# EAGLE design LAUNCHXL-F28069_B_1400922 (EAGLE 8.3.1)

## Sheet 1 of 4
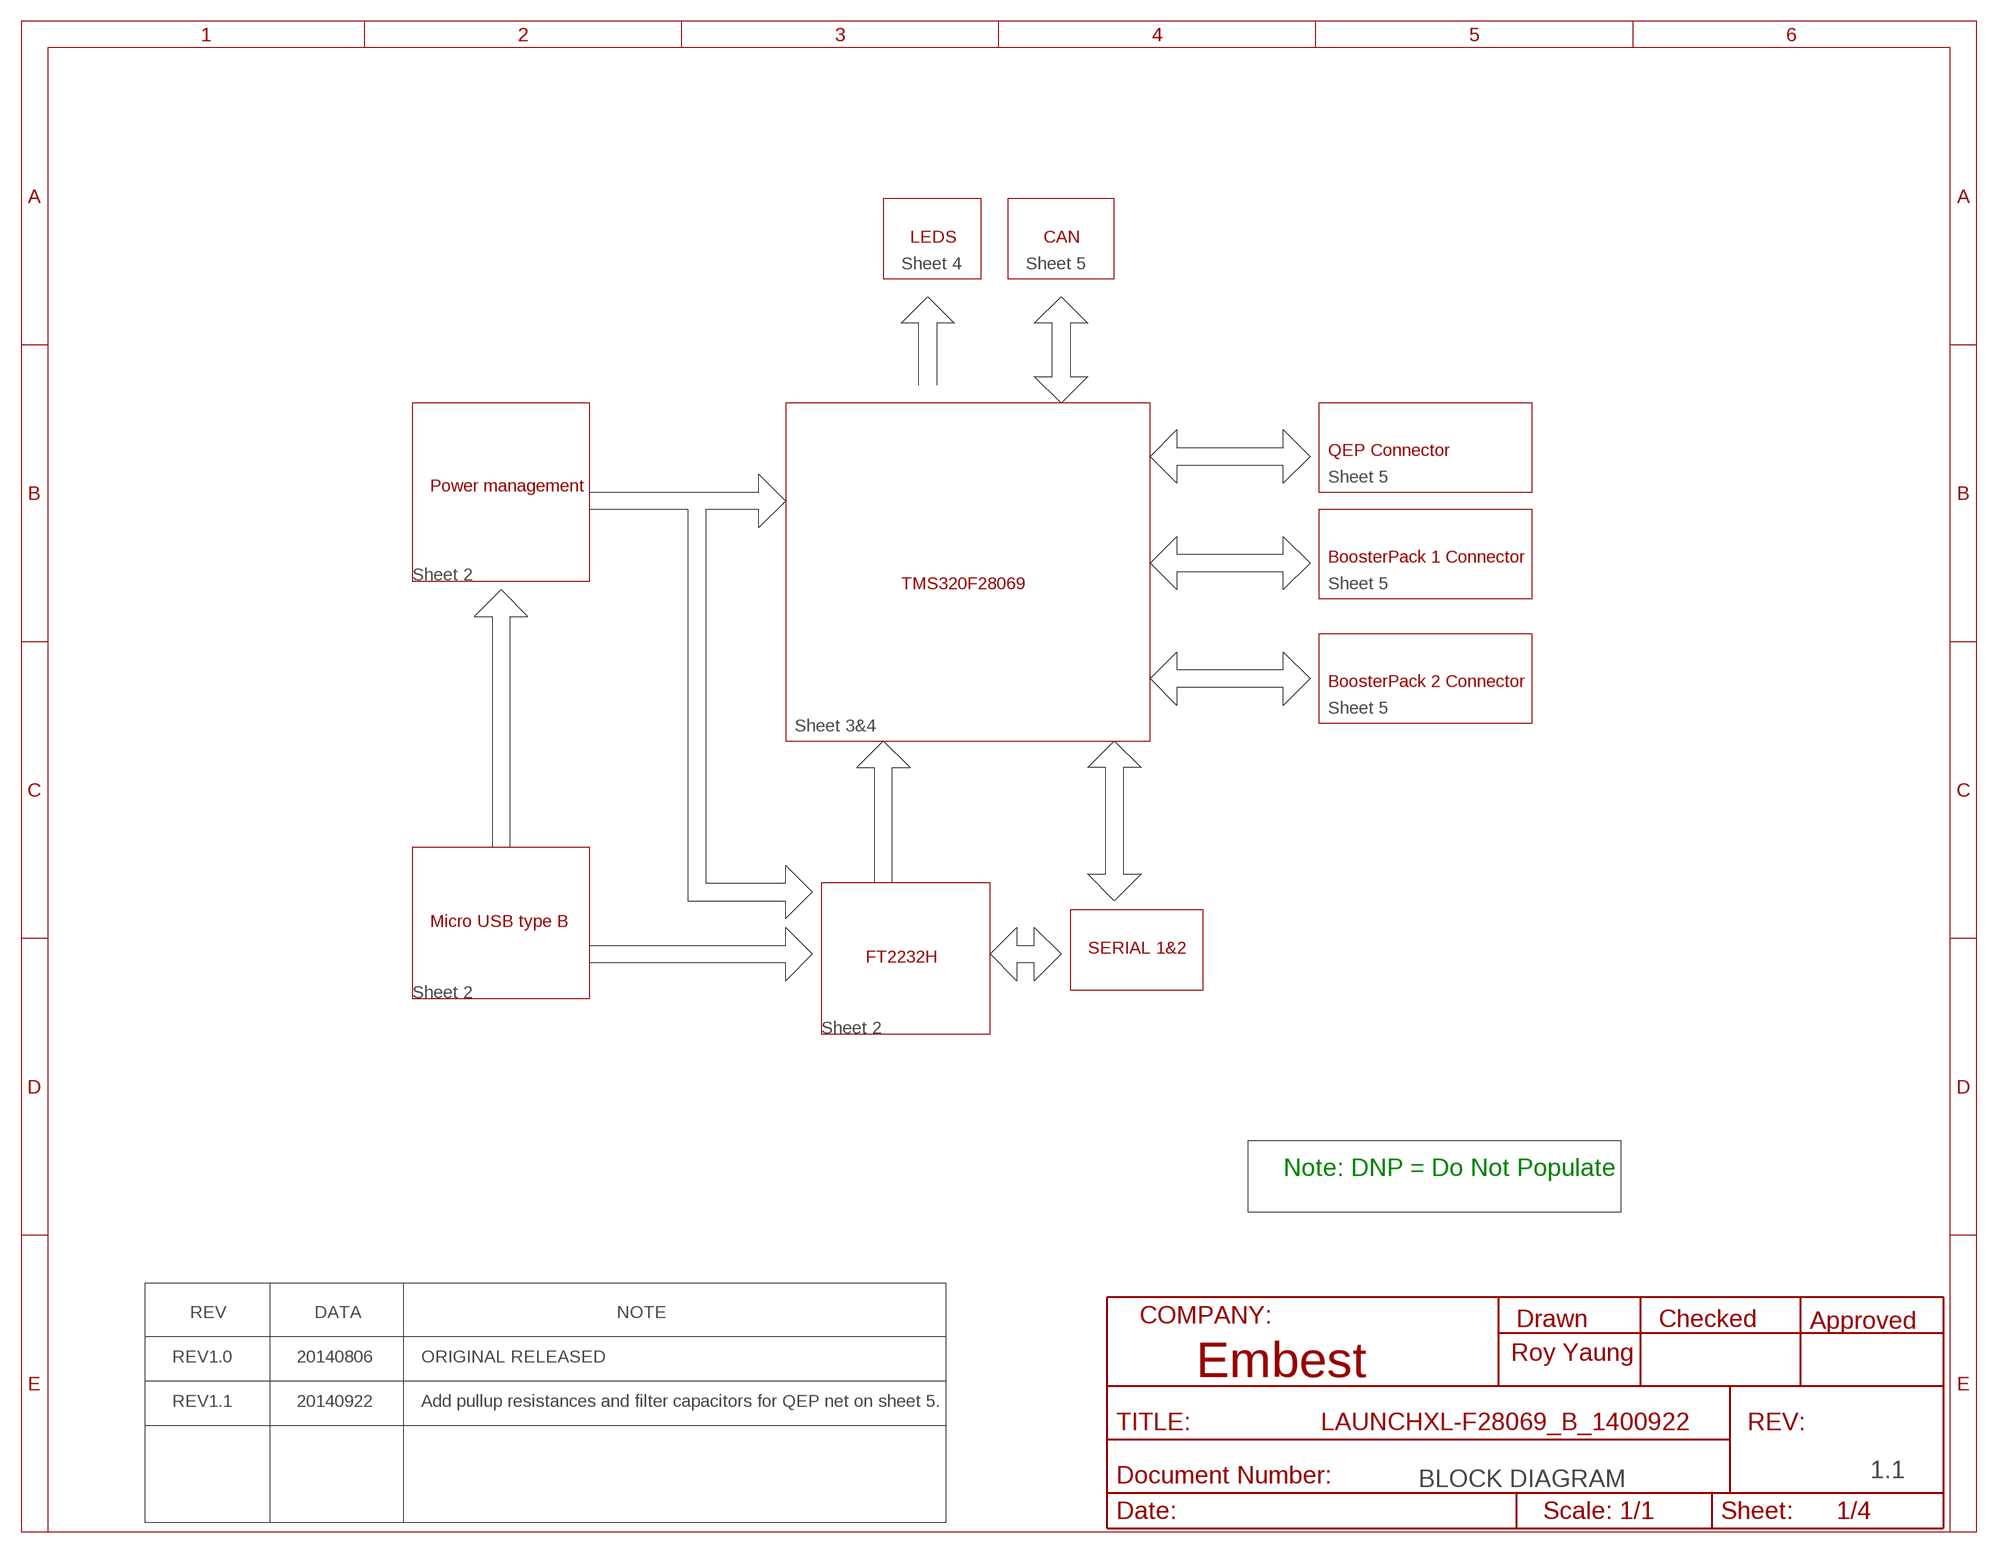
[diagram p0: schematic, sheet 1]

### Notes on the sheet
- LEDS | CAN
- Sheet 4 | Sheet 5
- QEP Connector
- Sheet 5
- Power management
- BoosterPack 1 Connector
- Sheet 2
- TMS320F28069 | Sheet 5
- BoosterPack 2 Connector
- Sheet 5
- Sheet 3&4
- Micro USB type B
- SERIAL 1&2
- FT2232H
- Sheet 2
- Sheet 2
- Note: DNP = Do Not Populate
- REV | DATA | NOTE
- REV1.0 | 20140806 | ORIGINAL RELEASED | Roy Yaung
- REV1.1 | 20140922 | Add pullup resistances and filter capacitors for QEP net on sheet 5.
- 1.1
- BLOCK DIAGRAM

## Sheet 2 of 4
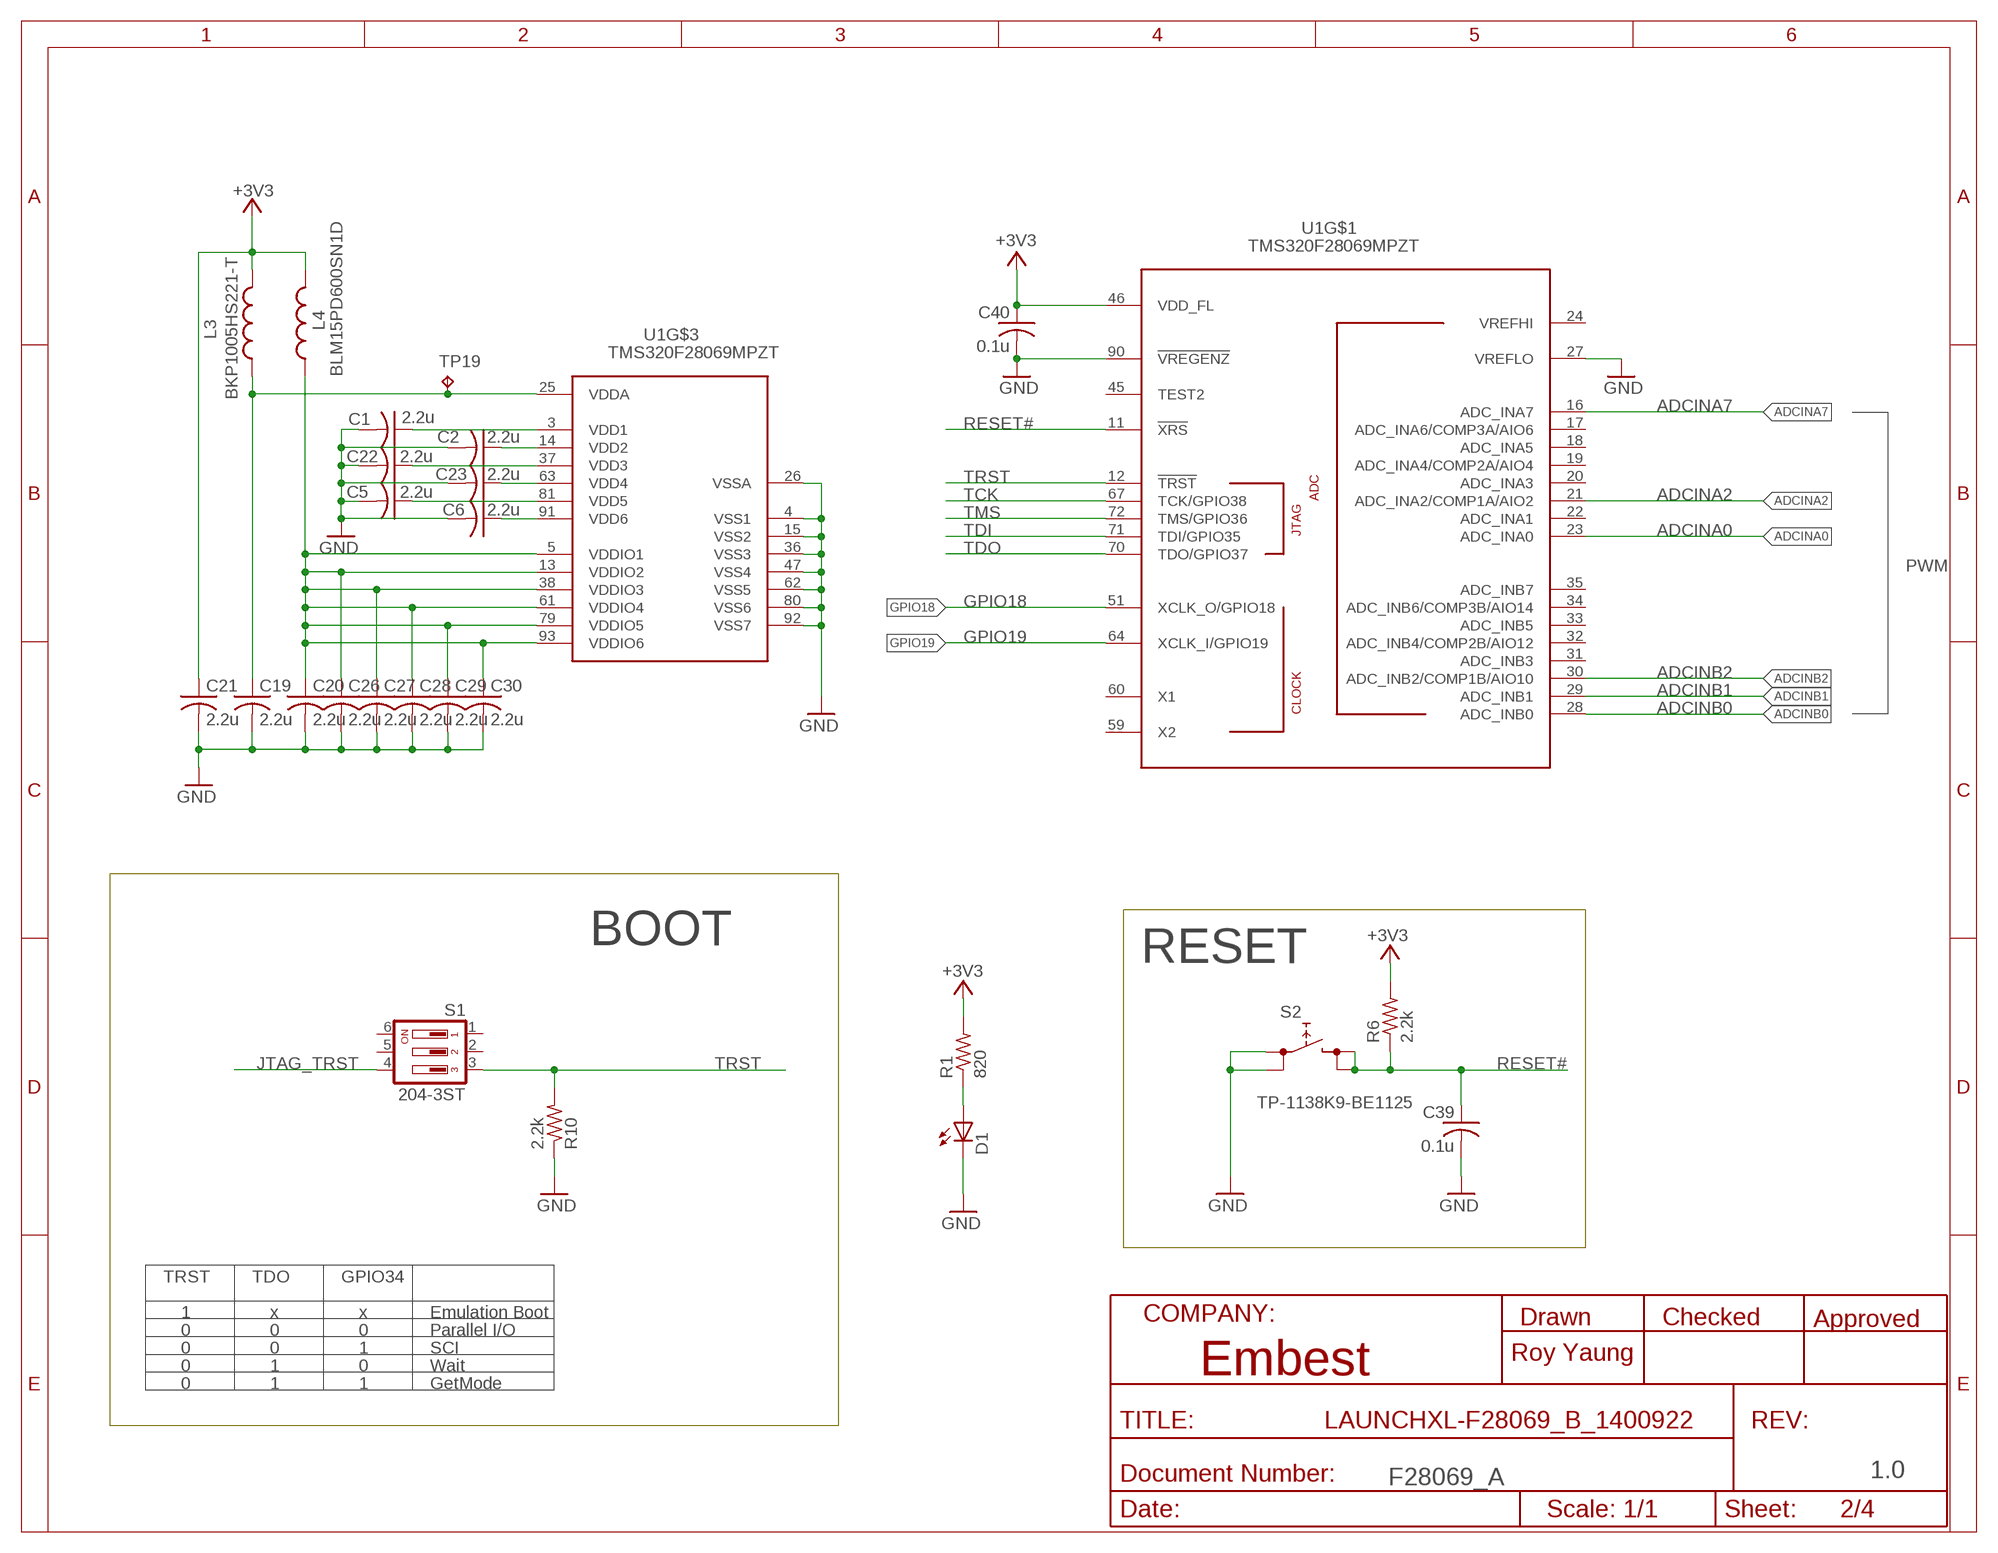
[diagram p1: schematic, sheet 2]

### Parts
C1  2.2u  C-USC0402  [C0402]
C2  2.2u  C-USC0402  [C0402]
C5  2.2u  C-USC0402  [C0402]
C6  2.2u  C-USC0402  [C0402]
C19  2.2u  C-USC0402  [C0402]
C20  2.2u  C-USC0402  [C0402]
C21  2.2u  C-USC0402  [C0402]
C22  2.2u  C-USC0402  [C0402]
C23  2.2u  C-USC0402  [C0402]
C26  2.2u  C-USC0402  [C0402]
C27  2.2u  C-USC0402  [C0402]
C28  2.2u  C-USC0402  [C0402]
C29  2.2u  C-USC0402  [C0402]
C30  2.2u  C-USC0402  [C0402]
C39  0.1u  C-USC0402  [C0402]
C40  0.1u  C-USC0402  [C0402]
D1  LEDCHIP-LED0603  [CHIP-LED0603]
L3  BKP1005HS221-T  L-US0402  [R0402]
L4  BLM15PD600SN1D  L-US0402  [R0402]
R1  820  R-US_R0402  [R0402]
R6  2.2k  R-US_R0402  [R0402]
R10  2.2k  R-US_R0402  [R0402]
S1  204-3ST  219-03  [CTS-219-03]
S2  TP-1138K9-BE1125  FSMJSMA  [FSMJSMA]
TP19  TESTPAD_TPB1,27  [TESTPAD_B1,27]
U1  TMS320F28069MPZT  TMS320F28069PZSR  [PQFP100]

### Nets
+3V3: C21.1 C40.1 L3.2 L4.2 R1.2 R6.2 U1.46(VDD_FL) ; also sheet 4
ADCINA0: U1.23(ADC_INA0) ; also sheet 4
ADCINA2: U1.21(ADC_INA2/COMP1A/AIO2) ; also sheet 4
ADCINA7: U1.16(ADC_INA7) ; also sheet 4
ADCINB0: U1.28(ADC_INB0) ; also sheet 4
ADCINB1: U1.29(ADC_INB1) ; also sheet 4
ADCINB2: U1.30(ADC_INB2/COMP1B/AIO10) ; also sheet 4
GND: C1.2 C2.2 C5.2 C6.2 C19.2 C20.2 C21.2 C22.2 C23.2 C26.2 C27.2 C28.2 C29.2 C30.2 C39.2 C40.2 D1.C R10.1 S2.P$1 S2.P$2 U1.4(VSS1) U1.15(VSS2) U1.26(VSSA) U1.27(VREFLO) U1.36(VSS3) U1.47(VSS4) U1.62(VSS5) U1.80(VSS6) U1.90(!VREGENZ) U1.92(VSS7) ; also sheet 4
GPIO18: U1.51(XCLK_O/GPIO18) ; also sheet 4
GPIO19: U1.64(XCLK_I/GPIO19) ; also sheet 4
JTAG_TRST: S1.4 ; also sheet 4
N$27: D1.A R1.1
N$28: C1.1 U1.3(VDD1)
N$29: C2.1 U1.14(VDD2)
N$30: C22.1 U1.37(VDD3)
N$31: C23.1 U1.63(VDD4)
N$35: C5.1 U1.81(VDD5)
N$36: C6.1 U1.91(VDD6)
RESET#: C39.1 R6.1 S2.P$3 S2.P$4 U1.11(!XRS) ; also sheet 4
TCK: U1.67(TCK/GPIO38) ; also sheet 4
TDI: U1.71(TDI/GPIO35) ; also sheet 4
TDO: U1.70(TDO/GPIO37) ; also sheet 4
TMS: U1.72(TMS/GPIO36) ; also sheet 4
TRST: R10.2 S1.3 U1.12(!TRST)
VDDA: C19.1 L3.1 TP19.TP U1.25(VDDA)
VDDIO: C20.1 C26.1 C27.1 C28.1 C29.1 C30.1 L4.1 U1.5(VDDIO1) U1.13(VDDIO2) U1.38(VDDIO3) U1.61(VDDIO4) U1.79(VDDIO5) U1.93(VDDIO6)
Unconnected: S1.1 S1.2 S1.5 S1.6 U1.17(ADC_INA6/COMP3A/AIO6) U1.18(ADC_INA5) U1.19(ADC_INA4/COMP2A/AIO4) U1.20(ADC_INA3) U1.22(ADC_INA1) U1.24(VREFHI) U1.31(ADC_INB3) U1.32(ADC_INB4/COMP2B/AIO12) U1.33(ADC_INB5) U1.34(ADC_INB6/COMP3B/AIO14) U1.35(ADC_INB7) U1.45(TEST2) U1.59(X2) U1.60(X1)

### Notes on the sheet
- PWM
- BOOT
- RESET
- TRST | TDO | GPIO34
- 1 | x | x | Emulation Boot
- 0 | 0 | 0 | Parallel I/O
- 0 | 0 | 1 | SCI
- Roy Yaung
- 0 | 1 | 0 | Wait
- 0 | 1 | 1 | GetMode
- 1.0
- F28069_A

## Sheet 3 of 4
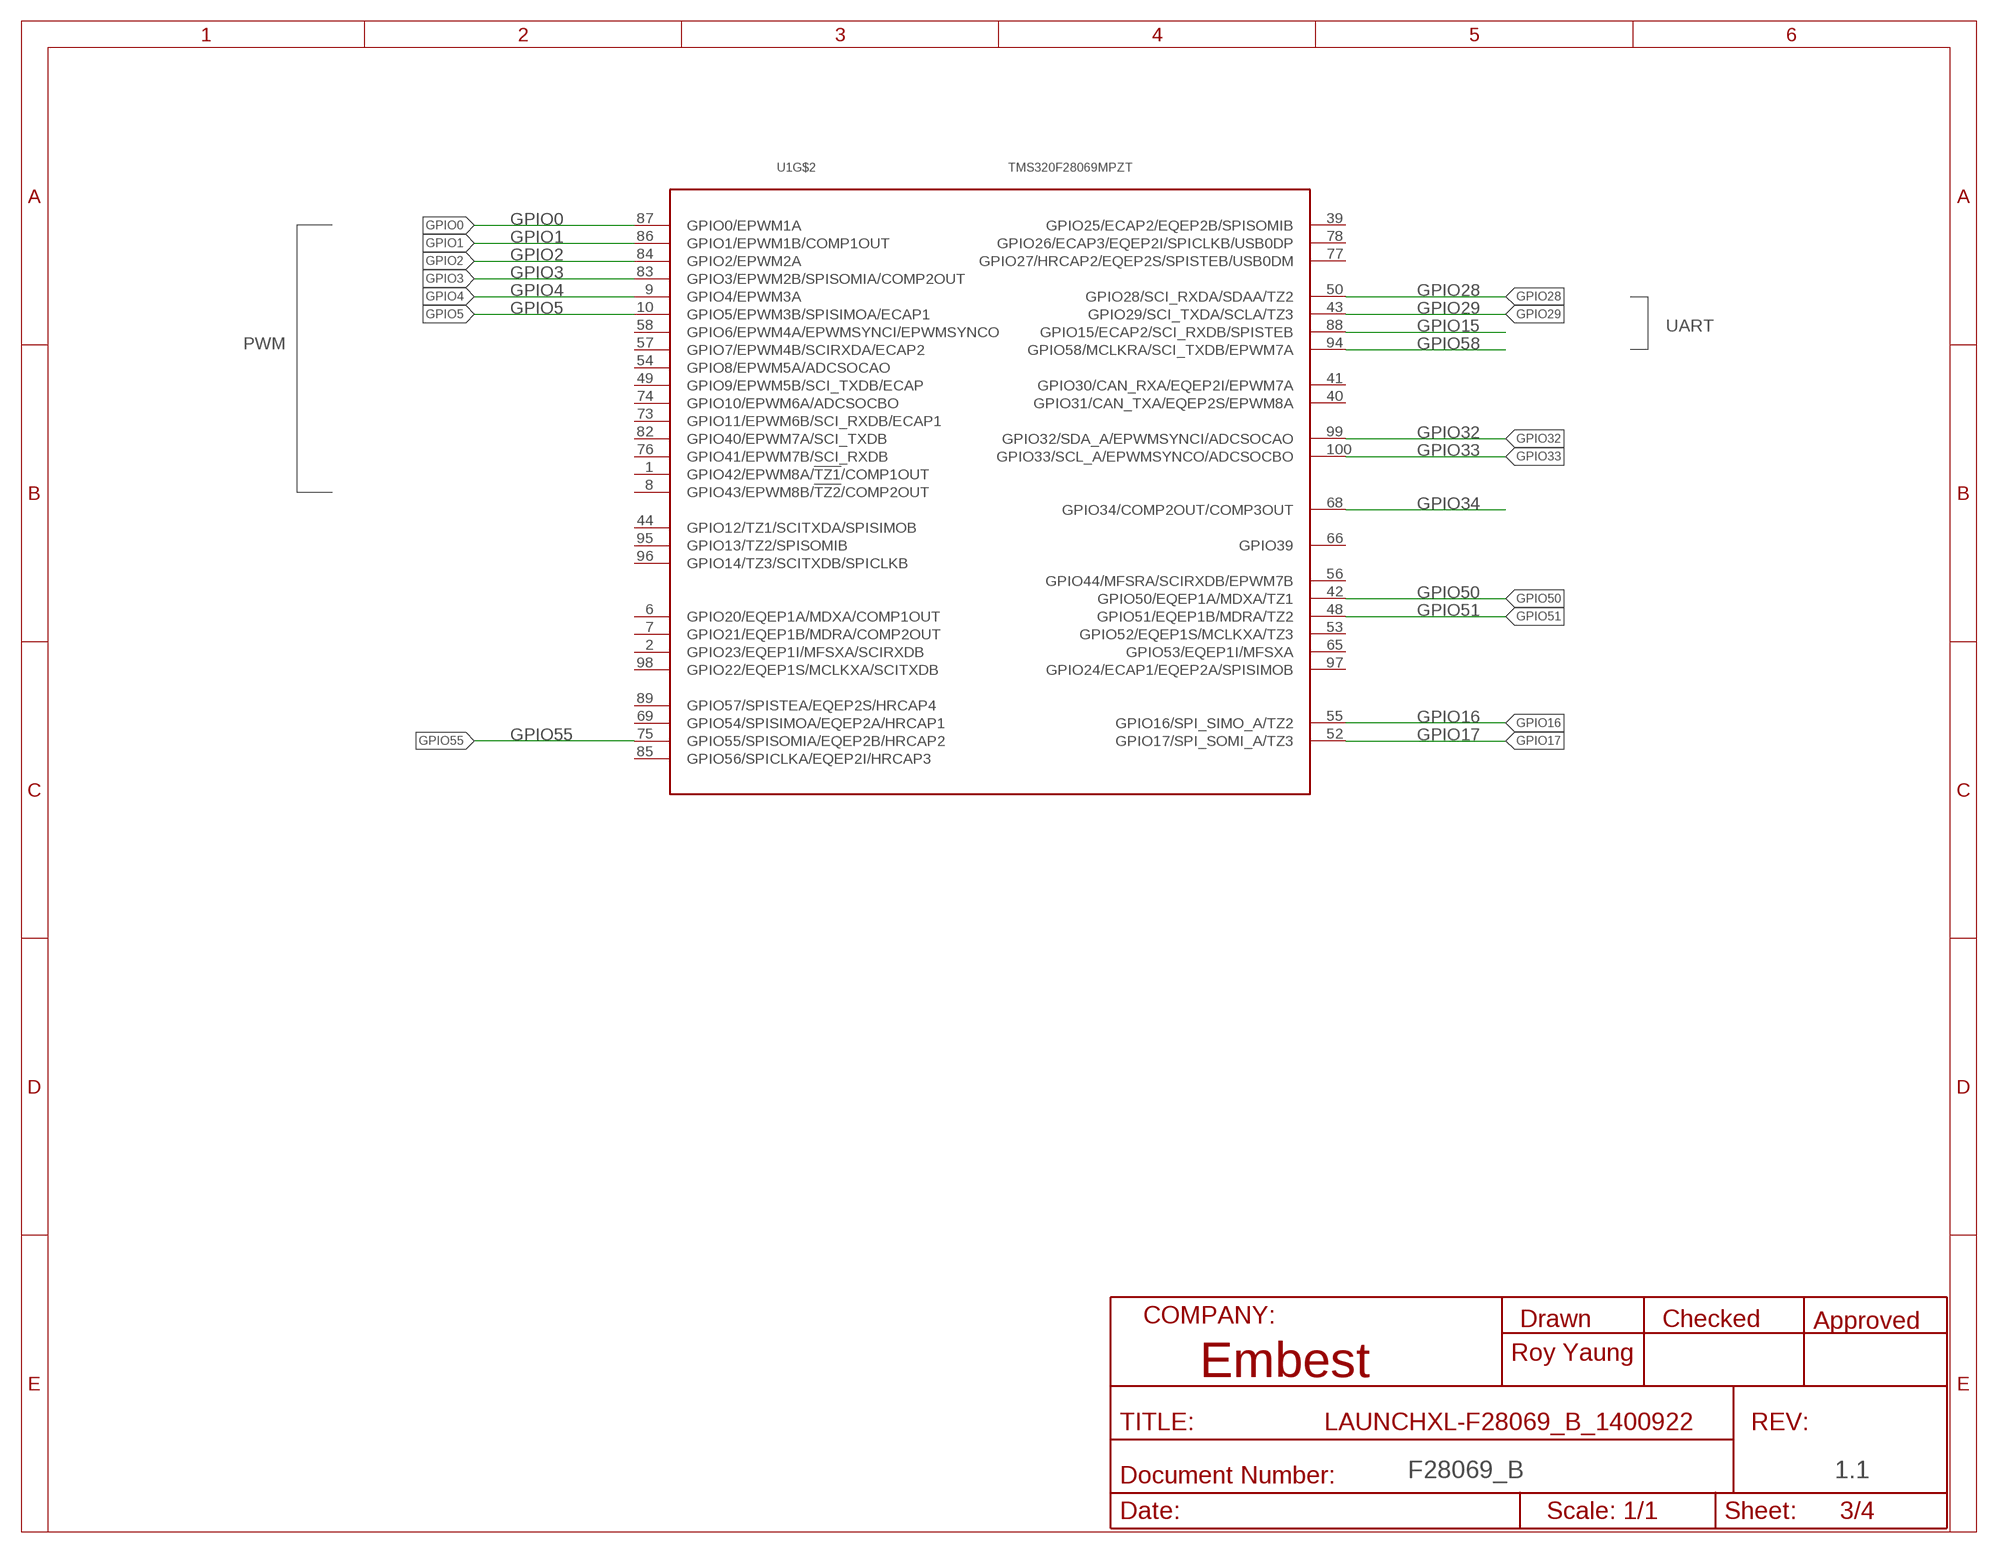
[diagram p2: schematic, sheet 3]

### Nets
GPIO0: U1.87(GPIO0/EPWM1A) ; also sheet 4
GPIO1: U1.86(GPIO1/EPWM1B/COMP1OUT) ; also sheet 4
GPIO2: U1.84(GPIO2/EPWM2A) ; also sheet 4
GPIO3: U1.83(GPIO3/EPWM2B/SPISOMIA/COMP2OUT) ; also sheet 4
GPIO4: U1.9(GPIO4/EPWM3A) ; also sheet 4
GPIO5: U1.10(GPIO5/EPWM3B/SPISIMOA/ECAP1) ; also sheet 4
GPIO15: U1.88(GPIO15/ECAP2/SCI_RXDB/SPISTEB)
GPIO16: U1.55(GPIO16/SPI_SIMO_A/TZ2) ; also sheet 4
GPIO17: U1.52(GPIO17/SPI_SOMI_A/TZ3) ; also sheet 4
GPIO28: U1.50(GPIO28/SCI_RXDA/SDAA/TZ2)
GPIO29: U1.43(GPIO29/SCI_TXDA/SCLA/TZ3)
GPIO32: U1.99(GPIO32/SDA_A/EPWMSYNCI/ADCSOCAO) ; also sheet 4
GPIO33: U1.100(GPIO33/SCL_A/EPWMSYNCO/ADCSOCBO) ; also sheet 4
GPIO34: U1.68(GPIO34/COMP2OUT/COMP3OUT)
GPIO50: U1.42(GPIO50/EQEP1A/MDXA/TZ1) ; also sheet 4
GPIO51: U1.48(GPIO51/EQEP1B/MDRA/TZ2) ; also sheet 4
GPIO55: U1.75(GPIO55/SPISOMIA/EQEP2B/HRCAP2) ; also sheet 4
GPIO58: U1.94(GPIO58/MCLKRA/SCI_TXDB/EPWM7A)
Unconnected: U1.1(GPIO42/EPWM8A/!TZ1!/COMP1OUT) U1.2(GPIO23/EQEP1I/MFSXA/SCIRXDB) U1.6(GPIO20/EQEP1A/MDXA/COMP1OUT) U1.7(GPIO21/EQEP1B/MDRA/COMP2OUT) U1.8(GPIO43/EPWM8B/!TZ2!/COMP2OUT) U1.39(GPIO25/ECAP2/EQEP2B/SPISOMIB) U1.40(GPIO31/CAN_TXA/EQEP2S/EPWM8A) U1.41(GPIO30/CAN_RXA/EQEP2I/EPWM7A) U1.44(GPIO12/TZ1/SCITXDA/SPISIMOB) U1.49(GPIO9/EPWM5B/SCI_TXDB/ECAP) U1.53(GPIO52/EQEP1S/MCLKXA/TZ3) U1.54(GPIO8/EPWM5A/ADCSOCAO) U1.56(GPIO44/MFSRA/SCIRXDB/EPWM7B) U1.57(GPIO7/EPWM4B/SCIRXDA/ECAP2) U1.58(GPIO6/EPWM4A/EPWMSYNCI/EPWMSYNCO) U1.65(GPIO53/EQEP1I/MFSXA) U1.66(GPIO39) U1.69(GPIO54/SPISIMOA/EQEP2A/HRCAP1) U1.73(GPIO11/EPWM6B/SCI_RXDB/ECAP1) U1.74(GPIO10/EPWM6A/ADCSOCBO) U1.76(GPIO41/EPWM7B/SCI_RXDB) U1.77(GPIO27/HRCAP2/EQEP2S/SPISTEB/USB0DM) U1.78(GPIO26/ECAP3/EQEP2I/SPICLKB/USB0DP) U1.82(GPIO40/EPWM7A/SCI_TXDB) U1.85(GPIO56/SPICLKA/EQEP2I/HRCAP3) U1.89(GPIO57/SPISTEA/EQEP2S/HRCAP4) U1.95(GPIO13/TZ2/SPISOMIB) U1.96(GPIO14/TZ3/SCITXDB/SPICLKB) U1.97(GPIO24/ECAP1/EQEP2A/SPISIMOB) U1.98(GPIO22/EQEP1S/MCLKXA/SCITXDB)

### Notes on the sheet
- UART
- PWM
- Roy Yaung
- F28069_B | 1.1

## Sheet 4 of 4
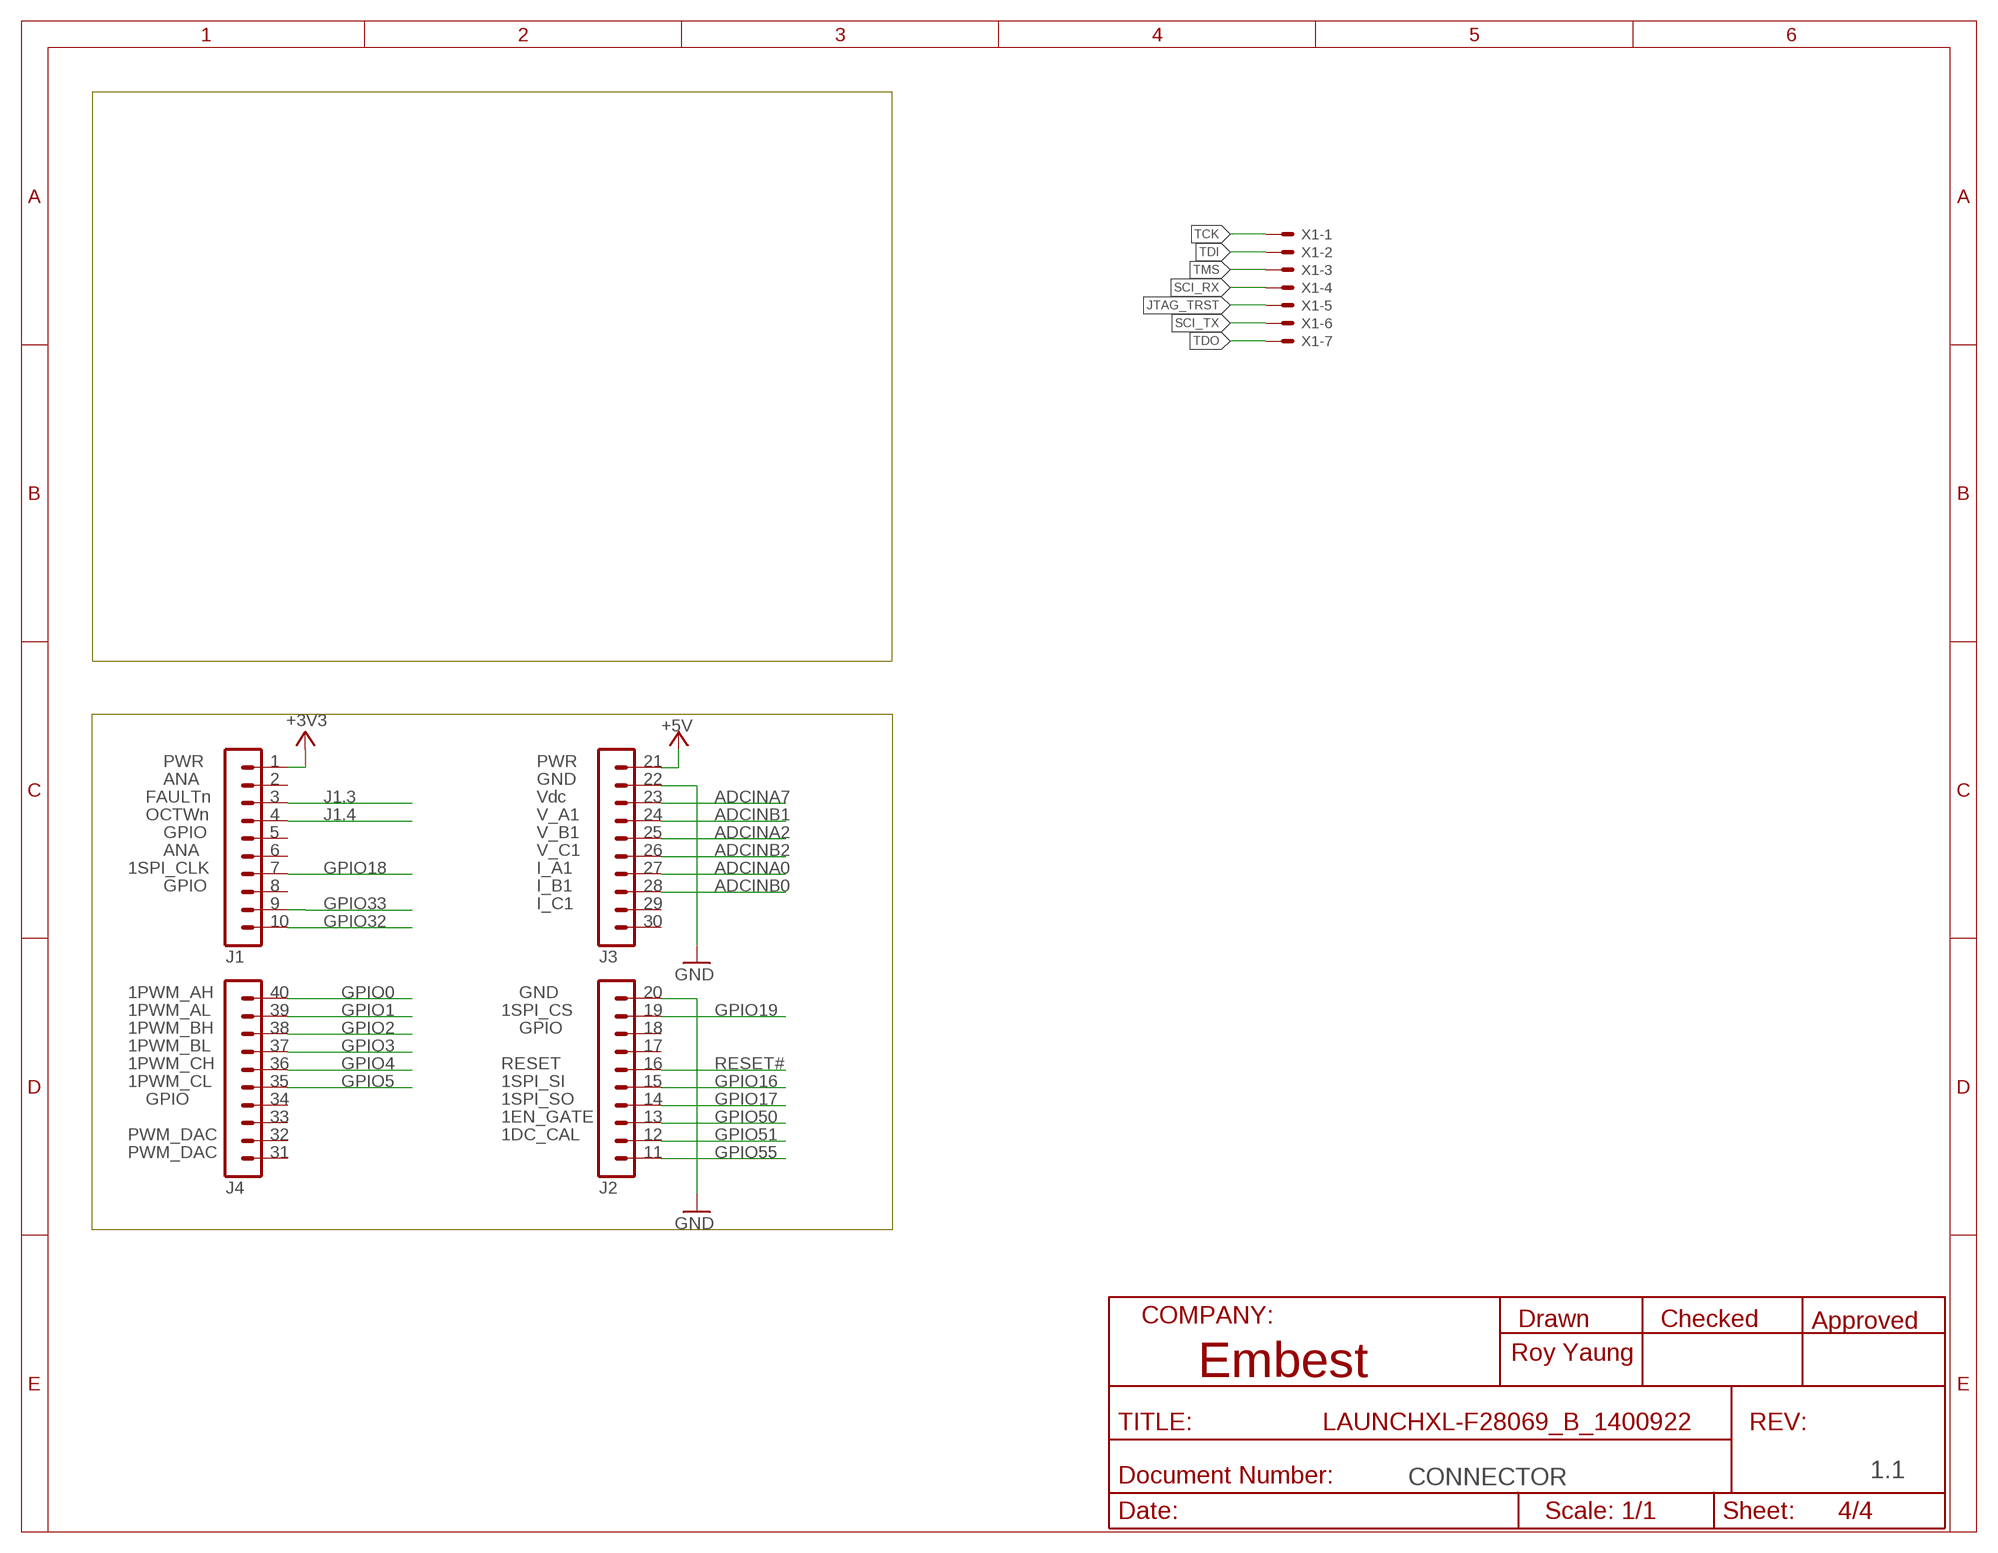
[diagram p3: schematic, sheet 4]

### Parts
J1  MA10-1  [MA10-1]
J2  MA10-1  [MA10-1]
J3  MA10-1  [MA10-1]
J4  MA10-1  [MA10-1]
X1  KK-156-7  [KK-156-7]

### Nets
+3V3: J1.1 ; also sheet 2
+5V: J3.1
ADCINA0: J3.7 ; also sheet 2
ADCINA2: J3.5 ; also sheet 2
ADCINA7: J3.3 ; also sheet 2
ADCINB0: J3.8 ; also sheet 2
ADCINB1: J3.4 ; also sheet 2
ADCINB2: J3.6 ; also sheet 2
GND: J2.1 J3.2 ; also sheet 2
GPIO0: J4.1 ; also sheet 3
GPIO1: J4.2 ; also sheet 3
GPIO2: J4.3 ; also sheet 3
GPIO3: J4.4 ; also sheet 3
GPIO4: J4.5 ; also sheet 3
GPIO5: J4.6 ; also sheet 3
GPIO16: J2.6 ; also sheet 3
GPIO17: J2.7 ; also sheet 3
GPIO18: J1.7 ; also sheet 2
GPIO19: J2.2 ; also sheet 2
GPIO32: J1.10 ; also sheet 3
GPIO33: J1.9 ; also sheet 3
GPIO50: J2.8 ; also sheet 3
GPIO51: J2.9 ; also sheet 3
GPIO55: J2.10 ; also sheet 3
J1.3: J1.3
J1.4: J1.4
JTAG_TRST: X1.5 ; also sheet 2
RESET#: J2.5 ; also sheet 2
SCI_RX: X1.4
SCI_TX: X1.6
TCK: X1.1 ; also sheet 2
TDI: X1.2 ; also sheet 2
TDO: X1.7 ; also sheet 2
TMS: X1.3 ; also sheet 2
Unconnected: J1.2 J1.5 J1.6 J1.8 J2.3 J2.4 J3.9 J3.10 J4.7 J4.8 J4.9 J4.10

### Notes on the sheet
- PWR | 1 | PWR | 21
- ANA | 2 | GND | 22
- FAULTn | 3 | Vdc | 23
- OCTWn | 4 | V_A1 | 24
- GPIO | 5 | V_B1 | 25
- ANA | 6 | V_C1 | 26
- 1SPI_CLK | 7 | I_A1 | 27
- GPIO | 8 | I_B1 | 28
- 9 | I_C1 | 29
- 10 | 30
- 1PWM_AH | 40 | GND | 20
- 1PWM_AL | 39 | 1SPI_CS | 19
- 1PWM_BH | 38 | GPIO | 18
- 1PWM_BL | 37 | 17
- 1PWM_CH | 36 | RESET | 16
- 1PWM_CL | 35 | 1SPI_SI | 15
- GPIO | 34 | 1SPI_SO | 14
- 33 | 1EN_GATE | 13
- PWM_DAC | 32 | 1DC_CAL | 12
- PWM_DAC | 31 | 11
- Roy Yaung
- 1.1
- CONNECTOR

## Library data of the parts
C1 C2 C5 C6 C19-C23 C26-C30 C39 C40 = rcl:C-US: CAPACITOR, American symbol
D1 = led:LED: LED OSRAM: - CHIPLED LG R971, LG N971, LY N971, LG Q971, LY Q971, LO R971, LY R971 LH N974, LH R974 LS Q976, LO Q976, LY Q976 LO Q996 - Hyper CHIPLED LW Q18S LB Q993, LB Q99A, LB R99A - SideLED LS A670, LO A670, LY A670, LG A670, LP A670 LB A673, LV A673, LT A673, LW A673 LH A674 LY A675 LS A676, LA A676, LO A676, LY A676, LW A676 LS A679, LY A679, LG A679 - Hyper Micro SIDELED® LS Y876, LA Y876, LO Y876, LY Y876 LT Y87S - SmartLED LW L88C, LW L88S LB L89C, LB L89S, LG L890 LS L89K, LO L89K, LY L89K LS L896, LA L896, LO L896, LY L896 - TOPLED LS T670, LO T670, LY T670, LG T670, LP T670 LSG T670, LSP T670, LSY T670, LOP T670, LYG T670 LG T671, LOG T671, LSG T671 LB T673, LV T673, LT T673, LW T673 LH T674 LS T676, LA T676, LO T676, LY T676, LB T676, LH T676, LSB T676, LW T676 LB T67C, LV T67C, LT T67C, LS T67K, LO T67K, LY T67K, LW E67C LS E67B, LA E67B, LO E67B, LY E67B, LB E67C, LV E67C, LT E67C LW T67C LS T679, LY T679, LG T679 LS T770, LO T770, LY T770, LG T770, LP T770 LB T773, LV T773, LT T773, LW T773 LH T774 LS E675, LA E675, LY E675, LS T675 LS T776, LA T776, LO T776, LY T776, LB T776 LHGB T686 LT T68C, LB T68C - Hyper Mini TOPLED® LB M676 - Mini TOPLED Santana® LG M470 LS M47K, LO M47K, LY M47K Source: http://www.osram.convergy.de LUXEON: - LUMILED® LXK2-PW12-R00, LXK2-PW12-S00, LXK2-PW14-U00, LXK2-PW14-V00 LXK2-PM12-R00, LXK2-PM12-S00, LXK2-PM14-U00 LXK2-PE12-Q00, LXK2-PE12-R00, LXK2-PE12-S00, LXK2-PE14-T00, LXK2-PE14-U00 LXK2-PB12-K00, LXK2-PB12-L00, LXK2-PB12-M00, LXK2-PB14-N00, LXK2-PB14-P00, LXK2-PB14-Q00 LXK2-PR12-L00, LXK2-PR12-M00, LXK2-PR14-Q00, LXK2-PR14-R00 LXK2-PD12-Q00, LXK2-PD12-R00, LXK2-PD12-S00 LXK2-PH12-R00, LXK2-PH12-S00 LXK2-PL12-P00, LXK2-PL12-Q00, LXK2-PL12-R00 Source: www.luxeon.com KINGBRIGHT: KA-3528ASYC Source: www.kingbright.com
J1-J4 = con-lstb:MA10-1: PIN HEADER; OC_FARNELL: unknown; OC_NEWARK: unknown
L3 L4 = rcl:L-US: INDUCTOR, American symbol
R1 R6 R10 = rcl:R-US_: RESISTOR, American symbol
S1 = switch-dil:219-03*: Surface Mount DIP Switch Series 219 SMT CTS Electronic Components Sourc: www.ctscorp.com; OC_FARNELL: unknown; OC_NEWARK: unknown
S2 = switch:FSMJSMA
TP19 = RF430FRL152H_EVM_a:TESTPAD_TP: Test pad
U1 = LAUNCHXL-F28027:TMS320F28069PZS
X1 = con-molex:KK-156-7: KK 156 HEADER Source: http://www.molex.com/pdm_docs/sd/026604100_sd.pdf; OC_FARNELL: unknown; OC_NEWARK: unknown

## Net classes
0 default: width 0.152 mm, drill 0.305 mm, clearance 0.152 mm

## Board
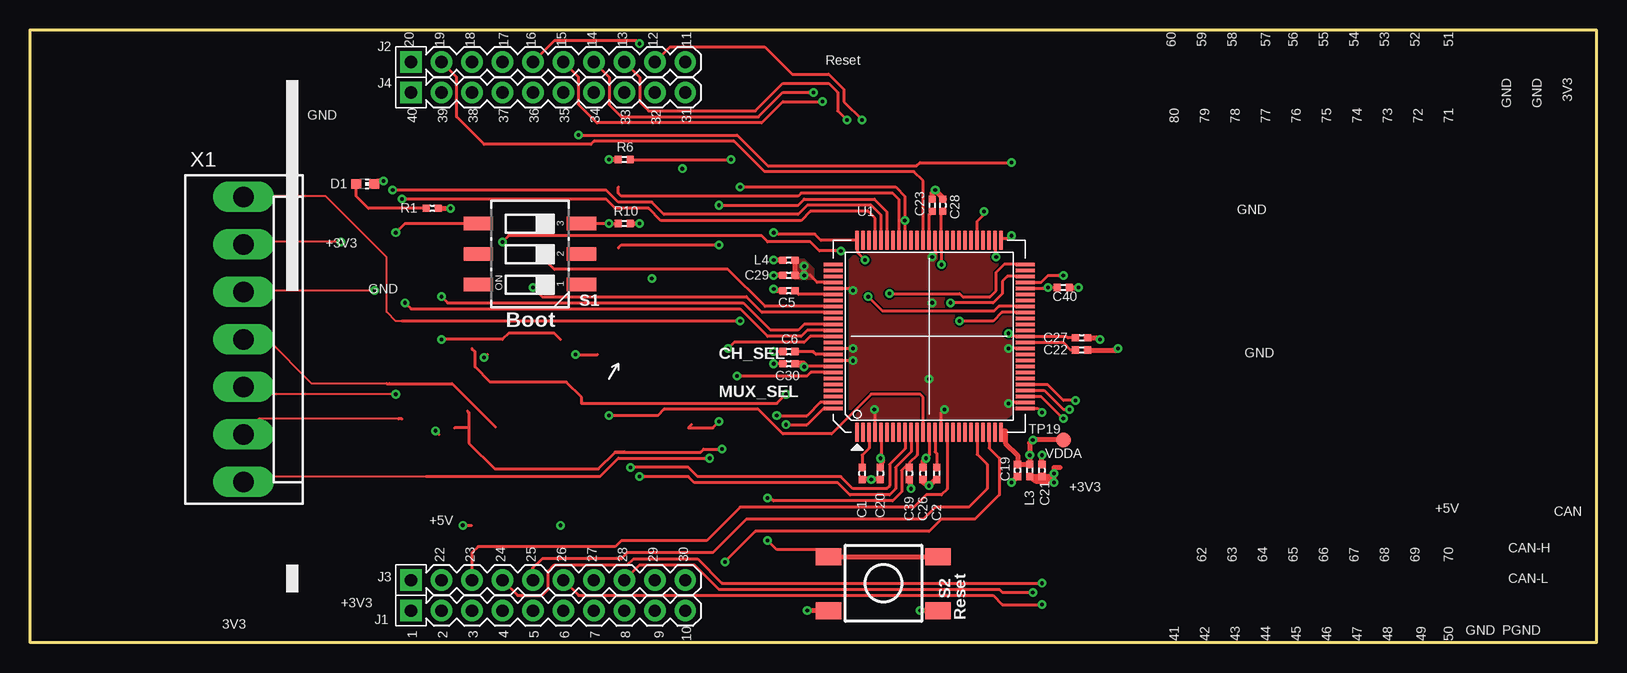
[diagram p4: board, top side]
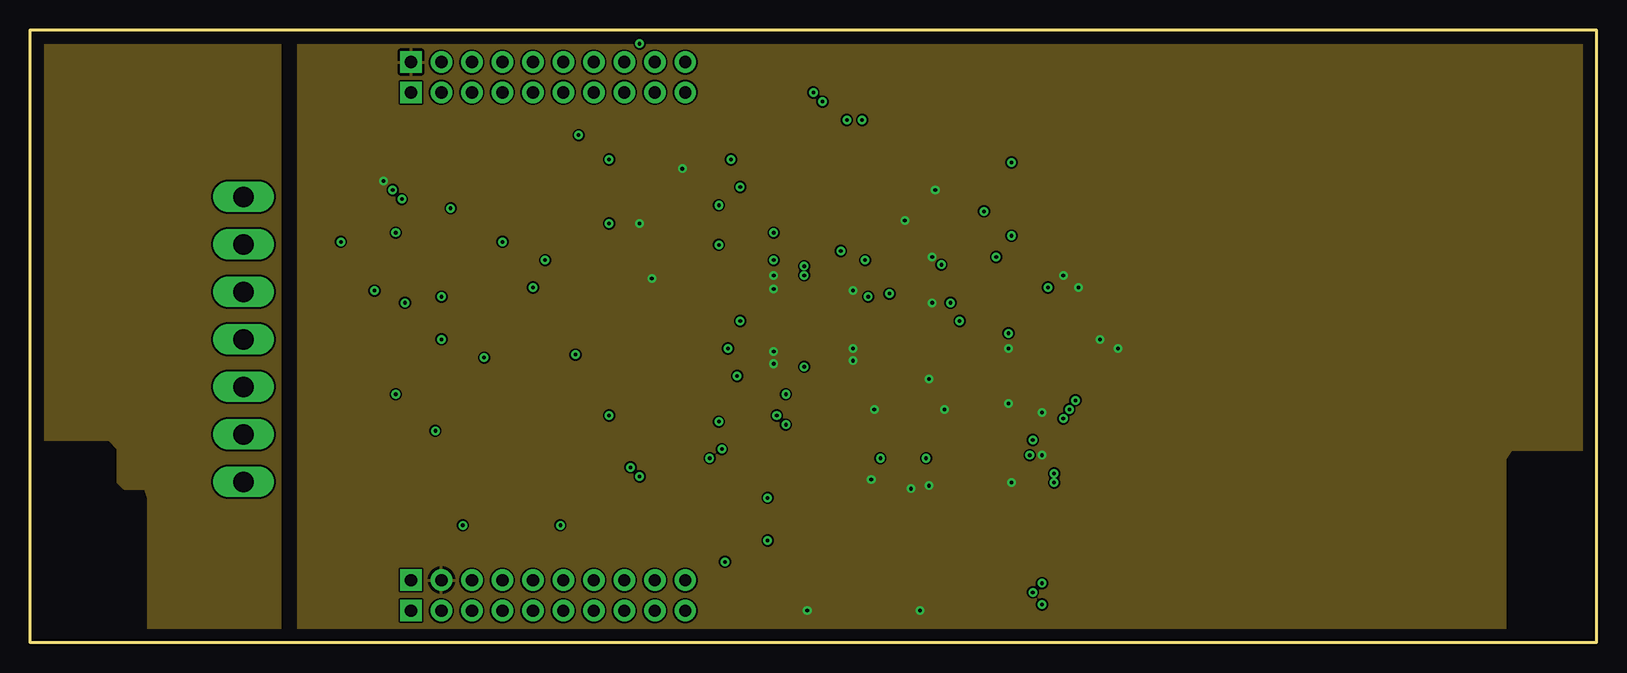
[diagram p5: board, inner layer GND]
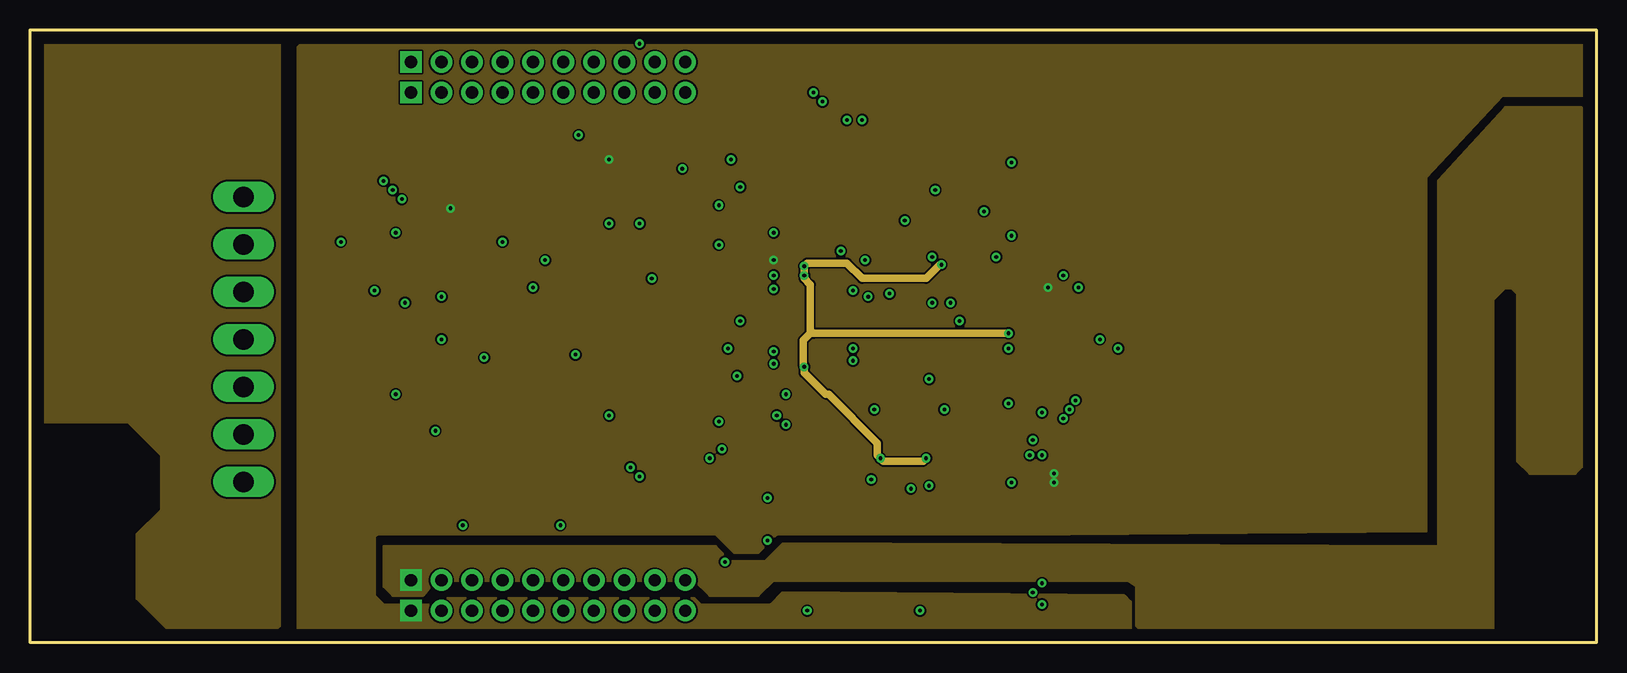
[diagram p6: board, inner layer VDD]
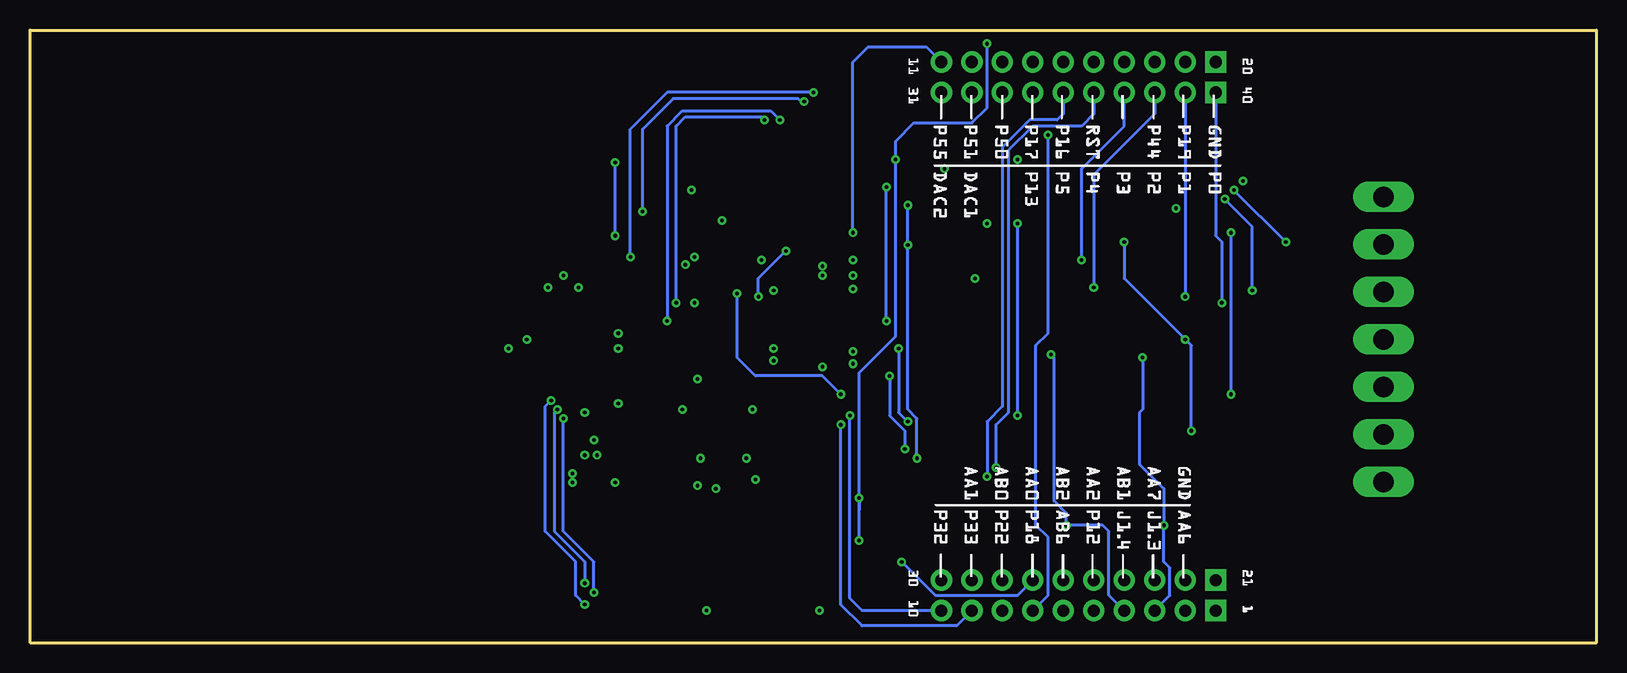
[diagram p7: board, bottom side, seen from below]

Size 130.56 x 51.05 mm. Coordinates in mm from the lower left corner, seen from the top.
Outline: 130.56,0 0,0 0,51.05 130.56,51.05 130.56,0
Copper layers (1*16): Top 0.035mm / dielectric 1.5mm / Bottom 0.035mm
Design rules "advanced_circuits_standard": minimum track width 5mil, minimum drill 10mil, track to track 5mil, track to pad 5mil, pad to pad 5mil, via to via 5mil, smd to smd 5mil, copper to edge 40mil, drill to drill 5mil, minimum pad ring 10mil, minimum via ring 8mil, stop-mask expansion 4mil, vias tented up to drill 0mil, thermal gap 10mil
bRestrict: area 21.8,38.7 to 24.4,41.3

### Footprints (pad centres in the part's own frame; a part is rotated, then mirrored left to right if it is on the bottom)
C0402 = smd 0.6 x 0.6: 1 -0.5,0; 2 0.5,0
CHIP-LED0603 = smd 0.8 x 0.8: A 0,-0.75; C 0,0.75
MA10-1 = drill 1.016 pad 1.778 square: 1 -11.43,0 | drill 1.016 pad 1.778: 2 -8.89,0; 3 -6.35,0; 4 -3.81,0; 5 -1.27,0; 6 1.27,0; 7 3.81,0; 8 6.35,0; 9 8.89,0; 10 11.43,0
R0402 = smd 0.6 x 0.6: 1 -0.5,0; 2 0.5,0
CTS-219-03 = smd 1.13 x 2.44: 1 -2.54,-4.3; 2 0,-4.3; 3 2.54,-4.3; 4 2.54,4.3; 5 0,4.3; 6 -2.54,4.3
FSMJSMA = smd 1.397 x 2.108: P$1 0,0; P$2 0,-9.119; P$3 4.496,0; P$4 4.496,-9.119
TESTPAD_B1,27 = smd 1.27 x 1.27: TP 0,0
PQFP100 = smd 1.6 x 0.3: 1 -8,6; 2 -8,5.5; 3 -8,5; 4 -8,4.5; 5 -8,4; 6 -8,3.5; 7 -8,3; 8 -8,2.5; 9 -8,2; 10 -8,1.5; 11 -8,1; 12 -8,0.5; 13 -8,0; 14 -8,-0.5; 15 -8,-1; 16 -8,-1.5; 17 -8,-2; 18 -8,-2.5; 19 -8,-3; 20 -8,-3.5; 21 -8,-4; 22 -8,-4.5; 23 -8,-5; 24 -8,-5.5; 25 -8,-6; 51 8,-6; 52 8,-5.5; 53 8,-5; 54 8,-4.5; 55 8,-4; 56 8,-3.5; 57 8,-3; 58 8,-2.5; 59 8,-2; 60 8,-1.5; 61 8,-1; 62 8,-0.5; 63 8,0; 64 8,0.5; 65 8,1; 66 8,1.5; 67 8,2; 68 8,2.5; 69 8,3; 70 8,3.5; 71 8,4; 72 8,4.5; 73 8,5; 74 8,5.5; 75 8,6 | smd 0.3 x 1.6: 26 -6,-8; 27 -5.5,-8; 28 -5,-8; 29 -4.5,-8; 30 -4,-8; 31 -3.5,-8; 32 -3,-8; 33 -2.5,-8; 34 -2,-8; 35 -1.5,-8; 36 -1,-8; 37 -0.5,-8; 38 0,-8; 39 0.5,-8; 40 1,-8; 41 1.5,-8; 42 2,-8; 43 2.5,-8; 44 3,-8; 45 3.5,-8; 46 4,-8; 47 4.5,-8; 48 5,-8; 49 5.5,-8; 50 6,-8; 76 6,8; 77 5.5,8; 78 5,8; 79 4.5,8; 80 4,8; 81 3.5,8; 82 3,8; 83 2.5,8; 84 2,8; 85 1.5,8; 86 1,8; 87 0.5,8; 88 0,8; 89 -0.5,8; 90 -1,8; 91 -1.5,8; 92 -2,8; 93 -2.5,8; 94 -3,8; 95 -3.5,8; 96 -4,8; 97 -4.5,8; 98 -5,8; 99 -5.5,8; 100 -6,8
KK-156-7 = drill 1.7 pad 2.184 long: 1 -11.88,0; 2 -7.92,0; 3 -3.96,0; 4 0,0; 5 3.96,0; 6 7.92,0; 7 11.88,0

### Placement (x,y rotation side)
C1  69.34,14.1 270 top
C2  75.56,14.1 270 top
C5  63.25,29.34 180 top
C6  63.25,24.26 180 top
C19  82.3,14.35 270 top
C20  70.87,14.1 270 top
C21  84.33,14.35 90 top
C22  87.63,24.38 0 top
C23  75.18,36.45 90 top
C26  74.42,14.1 270 top
C27  87.63,25.4 0 top
C28  76.07,36.45 90 top
C29  63.25,30.61 180 top
C30  63.25,23.24 180 top
C39  73.28,14.1 270 top
C40  86.11,29.59 0 top
D1  27.94,38.23 270 top
E$3  [F28069M_BACKSILK_2]  26.42,0.13 0 top
J1  43.18,2.67 0 top
J2  43.18,48.39 0 top
J3  43.18,5.21 0 top
J4  43.18,45.85 0 top
L3  83.31,14.35 270 top
L4  63.25,31.88 180 top
R1  33.53,36.2 0 top
R6  49.53,40.26 180 top
R10  49.53,34.93 180 top
S1  41.66,32.39 90 top
S2  66.55,2.67 90 top
TP19  86.11,16.89 0 top
U1  74.93,25.53 90 top
X1  17.78,25.27 270 top

### Tracks (layer width: path | path; a pad name or v marks a point on that pad's centre or on a via)
+3V3  (via drill 0.3)
  Top 0.254: 84.8,29.63 v84.84,29.59 | C40.1 v84.84,29.59 | U1.46 84.77,29.53 v84.84,29.59
  Top 0.406: 85.35,13.85 C21.1 L3.2 83.82,13.46 85.09,13.46 85.09,13.59 v85.34,13.34 v85.34,14.1 85.34,14.61 85.85,14.61 | R1.2 v35.05,36.2 | L4.2 v61.98,31.88 | R6.2 v48.26,40.26
  pour VDD (no thermals): 22.35,1.14 22.35,49.66 23.37,50.67 74.93,50.42 96.77,50.42 129.79,50.67 129.79,45.59 122.68,45.59 116.33,38.73 116.33,9.27 86.61,9.02 62.23,9.02 60.71,7.49 58.67,7.49 57.15,9.02 28.96,9.02 28.7,8.76 28.7,3.94 29.46,3.17 33.27,3.17 33.78,3.68 55.37,3.68 55.88,3.17 61.72,3.17 62.74,4.19 91.19,3.94 91.69,3.43 91.69,0.64 22.86,0.64
+5V
  pour VDD (no thermals): 29.46,8 29.46,4.7 30.23,3.94 32.77,3.94 33.78,5.21 55.37,5.21 56.64,3.94 60.71,3.94 61.98,5.21 91.44,5.21 92.2,4.7 92.2,1.4 92.71,0.89 121.92,0.89 121.92,28.57 122.94,29.59 123.44,29.59 123.95,29.08 123.95,15.11 124.97,14.1 128.78,14.1 129.79,15.11 129.79,44.07 129.29,44.58 122.94,44.58 117.35,38.48 117.35,8 62.74,8.26 61.21,6.73 58.42,6.73 57.15,8
ADCINA0  (via drill 0.3)
  Top 0.254: v57.91,6.73 60.45,9.27 74.93,9.27 75.95,10.29 78.74,10.29 80.77,12.32 80.77,15.37 79.93,16.21 U1.23
  Bottom 0.254: v57.91,6.73 55.12,3.94 48.26,3.94 J3.7
ADCINA2
  Top 0.254: J3.5 41.91,6.22 42.67,6.98 49.28,6.98 49.78,7.49 56.9,7.49 59.69,10.29 74.42,10.29 75.44,11.3 78.23,11.3 79.76,12.83 79.76,14.86 78.93,15.69 U1.21
ADCINA7
  Top 0.254: J3.3 36.83,7.49 37.34,8 48.77,8 49.28,8.51 56.39,8.51 59.18,11.3 73.66,11.3 74.68,12.32 75.95,12.32 76.43,12.8 U1.16
ADCINB0  (via drill 0.3)
  Top 0.254: J3.8 50.8,6.48 55.37,6.48 57.4,4.44 80.77,4.44 81.03,4.19 v83.57,4.19 | U1.28 84.25,20.53 v86.11,18.67
  Bottom 0.254: v83.57,4.19 83.57,6.73 86.11,9.27 v86.11,18.67
ADCINB1  (via drill 0.3)
  Top 0.254: v84.33,4.95 57.66,4.95 55.63,6.98 50.29,6.98 49.78,6.48 43.69,6.48 43.18,5.97 43.18,4.44 42.67,3.94 40.64,3.94 J3.4 | v86.61,19.43 86.11,19.43 84.51,21.03 U1.29
  Bottom 0.254: v86.61,19.43 86.87,19.18 86.87,9.27 84.33,6.73 v84.33,4.95
ADCINB2  (via drill 0.3)
  Top 0.254: J3.6 45.72,3.94 80.26,3.94 81.03,3.17 v84.33,3.17 | v87.12,20.19 86.11,20.19 84.77,21.53 U1.30
  Bottom 0.254: v84.33,3.17 85.09,3.94 85.09,6.73 87.63,9.27 87.63,19.68 v87.12,20.19
AGND
  pour GND: 0.25,50.42 20.83,50.42 20.83,0.38 10.16,0.38 9.91,0.64 9.91,12.07 9.65,12.83 7.87,12.83 7.37,13.34 7.37,16.13 6.6,16.89 0.51,16.89
FTDI_3V3
  pour VDD: 0.76,49.91 0.76,18.67 1.02,18.41 8.13,18.41 10.92,15.62 10.92,11.05 8.89,9.02 8.89,3.68 11.43,1.14 20.57,1.14 20.83,1.4 20.83,49.91
GND  (via drill 0.3)
  Top 0.254: v86.11,30.61 84.84,30.61 84.26,30.03 U1.47 | C30.2 v61.98,23.24 | C6.2 v61.98,24.26 | 76.06,19.29 v76.2,19.43 75.93,19.16 U1.15 | U1.80 68.39,29.53 v68.58,29.34 | U1.90 68.56,24.53 v68.58,24.51 | U1.92 68.55,23.53 v68.58,23.49 | U1.4 70.43,19.36 v70.36,19.43 | U1.26 83.98,19.53 v84.33,19.18 | U1.27 81.62,20.03 v81.53,19.94 | U1.36 81.55,24.53 v81.53,24.51 | U1.62 75.43,32.38 v75.18,32.13
  Top 0.406: C19.2 v81.79,13.34 | C21.2 v84.33,15.62 | R10.1 v50.79,34.93 v50.8,34.93 | C5.2 61.98,29.34 v61.98,29.46 | C29.2 v61.98,30.61 | C40.2 v87.38,29.59 | C27.2 89.03,25.4 v89.15,25.27 | C22.2 90.55,24.38 v90.68,24.51 | C2.2 75.44,13.59 v74.93,13.08 74.42,13.34 C26.2 | C1.2 C20.2 70.86,13.6 v70.1,13.59 | C39.2 v73.41,12.83 | D1.C 28.7,38.23 28.96,38.48 v29.46,38.48 | C23.2 75.18,37.47 v75.44,37.72 76.07,37.08 C28.2 76.19,36.95 76.2,36.96 | S2.P$1 v64.77,2.67 | S2.P$2 v74.17,2.67
  other vias: 54.36,39.5 51.82,30.35 74.93,21.97 75.18,28.32 72.9,35.18
  pour GND: 22.35,50.42 22.35,0.38 122.94,0.89 122.94,15.37 123.44,16.13 129.79,16.13 130.05,16.38 130.05,50.42
  pour Top: 68.33,31.88 68.33,19.43 69.09,18.67 81.28,18.67 82.3,19.43 82.3,19.68 81.79,20.19 81.79,31.88 81.03,32.64 69.09,32.64
GPIO0  (via drill 0.3)
  Top 0.254: v31.24,28.32 31.75,27.81 59.18,27.81 61.47,25.53 64.26,25.53 64.76,26.03 U1.87
  Bottom 0.254: J4.1 31.75,33.91 31.24,33.4 v31.24,28.32
GPIO1  (via drill 0.3)
  Top 0.254: v34.29,28.83 34.8,28.32 59.44,28.32 61.72,26.04 64.01,26.04 64.5,26.53 U1.86
  Bottom 0.254: J4.2 v34.29,28.83
GPIO2  (via drill 0.3)
  Top 0.254: v41.91,29.59 42.67,28.83 59.69,28.83 60.99,27.53 U1.84
  Bottom 0.254: J4.3 36.83,44.07 41.91,38.99 v41.91,29.59
GPIO3  (via drill 0.3)
  Top 0.254: v42.93,31.88 43.69,31.11 58.17,31.11 61.25,28.03 U1.83
  Bottom 0.254: v42.93,31.88 42.93,39.5 39.37,43.05 J4.4
GPIO4  (via drill 0.3)
  Top 0.254: v50.04,14.61 54.86,14.61 55.63,13.84 67.56,13.84 68.58,12.83 71.37,12.83 71.63,13.08 71.63,14.86 72.93,16.16 U1.9
  Bottom 0.254: J4.5 41.91,44.07 42.93,43.05 46.99,43.05 49.02,41.02 49.02,19.18 50.04,18.16 v50.04,14.61
GPIO5  (via drill 0.3)
  Top 0.254: v50.8,13.84 54.86,13.84 55.37,13.34 67.31,13.34 68.33,12.32 71.63,12.32 72.14,12.83 72.14,14.61 73.43,15.9 U1.10
  Bottom 0.254: J4.6 44.45,44.07 44.96,43.56 47.24,43.56 49.53,41.28 49.53,19.68 50.8,18.41 v50.8,13.84
GPIO15  (via drill 0.3)
  Top 0.254: v57.4,18.41 56.9,17.91 54.86,17.91 55.12,18.16 | v58.17,24.51 58.67,25.02 64.52,25.02 65.02,25.53 U1.88
  Bottom 0.254: v58.17,24.51 58.17,19.18 v57.4,18.41
GPIO16  (via drill 0.3)
  Top 0.254: v79.5,35.94 79.5,35.69 78.93,35.12 U1.55 | J2.6 45.72,47.12 45.72,44.83 47.24,43.31 60.96,43.31 62.74,45.09 v66.04,45.09
  Bottom 0.254: v79.5,35.94 79.5,42.8 76.96,45.34 66.55,45.34 66.29,45.09 v66.04,45.09
GPIO17  (via drill 0.3)
  Top 0.254: J2.7 48.26,47.12 48.26,44.83 49.28,43.82 60.71,43.82 62.74,45.85 v65.28,45.85 | 80.56,32.17 v80.52,32.13 80.43,32.22 U1.52
  Bottom 0.254: v80.52,32.13 80.52,42.8 77.47,45.85 v65.28,45.85
GPIO18  (via drill 0.3)
  Top 0.254: v81.79,33.91 81.56,33.69 81.06,33.69 81.06,33.65 U1.51 80.93,33.56 81.03,33.66 | v45.72,42.29 58.93,42.29 61.47,39.75 73.91,39.75 74.17,40.01 v81.79,40.01
  Bottom 0.254: v81.79,33.91 v81.79,40.01 | J1.7 45.72,3.94 45.72,8.76 46.74,9.78 46.74,24.77 45.72,25.78 v45.72,42.29
GPIO19
  Top 0.254: J2.2 35.56,47.12 35.56,43.82 37.85,41.53 46.74,41.53 46.99,41.78 58.67,41.78 61.21,39.24 73.66,39.24 74.43,38.47 U1.64
GPIO28  (via drill 0.3)
  Top 0.254: v62.99,20.7 62.23,19.94 46.48,19.94 45.97,19.94 45.97,20.45 44.7,21.72 38.35,21.72 37.08,22.99 37.08,24.26 36.83,24.51 | v71.63,29.08 77.47,29.08 77.72,28.83 80.01,28.83 80.52,29.34 80.52,30.86 81.18,31.53 U1.50
  Bottom 0.254: v62.99,20.7 64.52,22.22 70.1,22.22 71.63,23.75 v71.63,29.08
GPIO29  (via drill 0.3)
  Top 0.254: 44.2,25.27 43.69,25.78 39.88,25.78 39.37,25.27 v34.29,25.27 | v69.85,28.83 71.06,27.62 80.33,27.62 80.73,28.03 U1.43 | v67.56,32.64 65.79,32.64 65.02,33.4 61.47,33.4 60.96,33.91 39.88,33.91 v39.37,33.4 | 34.1,17.34 v33.78,17.65
  Bottom 0.254: v33.78,17.65 33.78,24.77 v34.29,25.27 39.37,30.35 v39.37,33.4 | v69.85,28.83 69.85,30.35 v67.56,32.64
GPIO32  (via drill 0.3)
  Top 0.254: v62.23,18.92 64.77,18.92 65.87,20.03 U1.99
  Bottom 0.254: J1.10 61.21,2.67 62.23,3.68 v62.23,18.92
GPIO33  (via drill 0.3)
  Top 0.254: U1.100 66.14,19.53 64.77,18.16 v62.99,18.16
  Bottom 0.254: J1.9 53.34,1.4 61.21,1.4 62.99,3.17 v62.99,18.16
GPIO34
  Top 0.254: 49.02,37.97 49.02,37.47 49.28,37.21 64.01,37.21 64.26,37.47 71.88,37.47 72.43,36.92 U1.68
GPIO50  (via drill 0.3)
  Top 0.254: J2.8 50.8,47.12 50.8,45.09 51.56,44.32 60.45,44.32 62.74,46.61 66.55,46.61 67.31,45.85 67.31,44.32 v68.07,43.56 | v77.47,26.8 80.26,26.8 80.99,27.53 U1.42
  Bottom 0.254: v77.47,26.8 77.47,43.05 76.2,44.32 68.83,44.32 v68.07,43.56
GPIO51  (via drill 0.3)
  Top 0.254: v76.71,28.32 80.26,28.32 81.03,29.08 81.03,30.1 81.45,30.53 U1.48 | J2.9 53.34,49.66 61.21,49.66 63.5,47.37 66.55,47.37 67.82,46.1 67.82,45.09 v69.34,43.56
  Bottom 0.254: v76.71,28.32 76.71,43.05 75.95,43.82 69.6,43.82 v69.34,43.56
GPIO55  (via drill 0.3)
  Top 0.254: v61.98,34.16 62.36,34.04 65.4,34.04 65.91,33.53 U1.75 68.93,32.54 v69.6,31.88
  Bottom 0.254: v61.98,34.16 61.98,48.39 60.71,49.66 55.88,49.66 J2.10
GPIO58  (via drill 0.3)
  Top 0.254: 48.77,15.88 47.37,14.48 38.73,14.48 36.58,16.64 36.58,17.91 | 48.77,15.88 55.88,15.88 56.13,16.13 v57.66,16.13 | v58.93,22.22 64.77,22.22 65.07,22.53 U1.94 | 49.56,15.91 48.77,15.88 | 36.46,19.29 36.58,19.18 36.58,17.91 | 36.58,17.91 35.39,17.91 | 36.49,17.99 36.58,17.91
  Bottom 0.254: v58.93,22.22 58.93,18.92 57.66,17.65 v57.66,16.13
J1.3  (via drill 0.3)
  Top 0.254: v36.07,9.78 36.8,9.78 | 38.11,24.01 v37.85,23.75
  Bottom 0.254: J1.3 35.56,3.94 35.56,6.22 36.07,6.73 v36.07,9.78 36.07,12.83 38.1,14.86 38.1,19.18 37.85,19.43 v37.85,23.75
J1.4  (via drill 0.3)
  Top 0.254: 44.35,9.88 v44.2,9.78 | v45.47,24 47.29,24
  Bottom 0.254: v45.47,24 45.21,23.75 45.21,11.81 44.2,10.79 v44.2,9.78 41.15,9.78 40.64,9.27 40.64,3.94 J1.4
JTAG_TRST  (via drill 0.3)
  Top 0.152: v30.48,20.7 18.39,20.7 X1.5
  Top 0.254: S1.4 31.24,34.93 v30.48,34.16
  Bottom 0.254: v30.48,34.16 v30.48,20.7
N$27
  Top 0.254: R1.1 28.19,36.2 27.18,37.21 27.18,38.22 D1.A
N$28
  Top 0.254: C1.1 69.34,15.62 69.93,16.21 U1.3
N$29
  Top 0.254: C2.1 75.56,15.75 75.43,15.88 U1.14
N$30
  Top 0.254: C22.1 86.74,24.38 86.1,25.03 U1.37
N$31
  Top 0.254: 75.06,35.69 75.18,35.81 C23.1 74.93,35.7 U1.63
N$35
  Top 0.254: 63.93,29.15 C5.1 64.06,29.03 U1.81
N$36
  Top 0.254: 63.85,24.15 C6.1 65.28,24.26 65.51,24.03 U1.91
RESET#  (via drill 0.3)
  Top 0.254: v50.8,49.91 50.55,50.16 43.69,50.16 J2.5 | U1.11 73.93,15.64 73.28,14.99 C39.1 72.91,14.6 72.9,14.61 72.64,14.35 72.64,12.57 71.88,11.81 61.98,11.81 v61.47,12.07 | S2.P$3 66.12,7.16 65.79,7.75 62.23,7.75 v61.47,8.51 | R6.1 v58.42,40.26
  Top 0.406: S2.P$3 S2.P$4
  Bottom 0.254: v61.47,12.07 61.47,11.05 | v61.47,12.07 61.47,22.48 58.42,25.53 v58.42,40.26 58.42,41.78 56.9,43.31 52.07,43.31 50.8,44.58 v50.8,49.91 | v61.47,8.51 v61.47,12.07
SCI_RX
  Top 0.152: 29.97,21.59 23.5,21.59 19.81,25.27 X1.4
  Top 0.254: 38.78,17.99 35.18,21.59 29.97,21.59 29.72,21.59
SCI_TX
  Top 0.152: 30.99,18.64 19.07,18.64 X1.6
  Top 0.254: 30.99,18.64 30.7,18.64
TCK  (via drill 0.3)
  Top 0.152: 30.99,26.8 30.48,26.8 29.72,27.56 29.72,32.13 24.64,37.21 17.84,37.21 X1.1
  Top 0.254: v59.18,26.8 30.99,26.8 | v59.18,37.97 72.14,37.97 72.93,37.18 U1.67
  Bottom 0.254: v59.18,26.8 v59.18,37.97
TDI  (via drill 0.3)
  Top 0.152: v25.91,33.4 17.99,33.4 X1.2
  Top 0.254: v30.23,37.72 48.01,37.72 49.02,36.7 51.82,36.7 52.83,35.69 64.01,35.69 64.77,36.45 70.1,36.45 70.93,35.62 U1.71
  Bottom 0.254: v30.23,37.72 v25.91,33.4
TDO  (via drill 0.3)
  Top 0.152: 33.02,13.84 18.23,13.84 X1.7
  Top 0.254: 49.03,32.9 49.28,33.15 v57.4,33.15 | v57.4,36.45 64.01,36.45 64.52,36.96 70.36,36.96 71.43,35.89 U1.70 | 33.02,13.84 47.5,13.84 49.02,15.37 v56.64,15.37
  Bottom 0.254: v57.4,36.45 v57.4,33.15 57.4,19.43 56.64,18.67 v56.64,15.37
TMS  (via drill 0.3)
  Top 0.152: v28.7,29.34 17.88,29.34 X1.3
  Top 0.254: v30.99,36.96 48.01,36.96 48.77,36.2 51.56,36.2 52.58,35.18 64.26,35.18 65.02,35.94 69.85,35.94 70.43,35.36 U1.72
  Bottom 0.254: v28.7,29.34 28.7,34.67 v30.99,36.96
TRST  (via drill 0.3)
  Top 0.254: v48.26,18.92 52.32,18.92 52.83,19.43 60.71,19.43 62.74,17.4 66.8,17.4 70.1,20.7 74.17,20.7 74.43,20.44 U1.12 | R10.2 v48.26,34.93 S1.3
  Bottom 0.254: v48.26,18.92 v48.26,34.93
VDDA  (via drill 0.3)
  Top 0.254: 81.15,17.78 81.28,17.65 | U1.25 81.15,17.53 81.28,17.4
  Top 0.406: 81.28,17.65 81.28,17.4 81.28,16.64 82.3,15.62 C19.1 L3.1 v83.31,15.62 83.31,16.64 v83.57,16.89 TP19.TP
VDDIO  (via drill 0.3)
  Top 0.254: C27.1 86.49,25.4 86.36,25.53 U1.38 81.79,25.53 v81.53,25.78 81.69,25.63 | 64.72,23.15 64.52,23.37 64.01,23.37 C30.1 63.88,23.24 64.01,23.11 63.88,23.11 C30.1 | 71.06,15.05 70.87,14.86 C20.1 | 76.06,35.93 C28.1 75.93,35.81 U1.61 75.93,31.51 v75.95,31.5 | v64.52,30.61 65.02,30.61 65.6,30.03 U1.79 | U1.93 64.56,23.03 v64.52,22.99 | U1.5 70.93,15.43 v70.87,15.37 | U1.13 74.93,15.62 v74.68,15.37
  Top 0.406: L4.1 C29.1 | 71.06,15.05 71.06,15.18 v70.87,15.37 | C26.1 74.42,15.11 v74.68,15.37 | C29.1 v64.52,30.61 v64.52,31.37 | C30.1 v64.52,22.99 64.17,23.15
  VDD 0.406: 64.43,23.15 v64.52,22.99
  VDD 0.61: v64.52,22.99 64.52,22.48 66.29,20.7 66.55,20.7 70.61,16.64 70.61,15.62 v70.87,15.37 71.12,15.11 74.42,15.11 v74.68,15.37 | 64.43,23.15 64.43,25.19 65.02,25.78 65.02,26.04 | 65.02,26.04 65.02,29.84 64.52,30.35 v64.52,30.61 v64.52,31.37 64.77,31.62 68.07,31.62 69.34,30.35 74.68,30.35 75.82,31.5 v75.95,31.5 | v81.53,25.78 65.28,25.78 65.02,26.04
  pour Top (no thermals): 63.75,31.88 63.75,30.35 65.28,30.35 65.28,31.11 64.52,31.88

### Text on the board
tNames: 20 | 19 | 18 | 17 | 16 | 15 | 14 | 13 | 12 | 11 | 60 | 59 | 58 | 57 | 56 | 55 | 54 | 53 | 52 | 51 | Reset | 3V3 | GND | GND | GND | 40 | 39 | 38 | 37 | 36 | 35 | 34 | 33 | 32 | 31 | 80 | 79 | 78 | 77 | 76 | 75 | 74 | 73 | 72 | 71 | GND | +3V3 | GND | Boot | GND | CH_SEL | MUX_SEL | VDDA | +3V3 | +5V | +5V | CAN | 22 | 23 | 24 | 25 | 26 | 27 | 28 | 29 | 30 | 62 | 63 | 64 | 65 | 66 | 67 | 68 | 69 | 70 | CAN-H | CAN-L | +3V3 | Reset | 3V3 | GND | PGND | 1 | 2 | 3 | 4 | 5 | 6 | 7 | 8 | 9 | 10 | 41 | 42 | 43 | 44 | 45 | 46 | 47 | 48 | 49 | 50